# EAGLE schematic Gleichrichter (EAGLE 9.6.2)
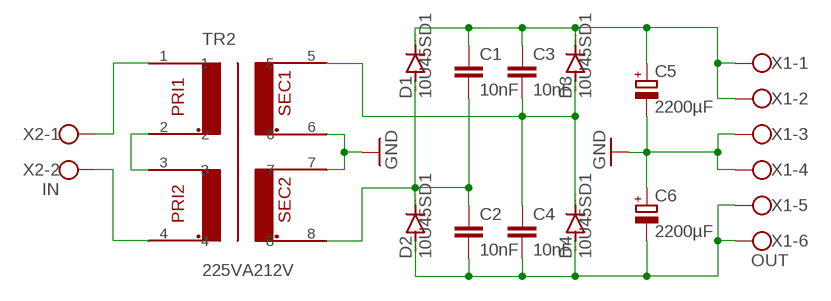
[diagram p0: schematic, sheet 1]

## Parts
C1  10nF  C-EU050-024X044  [C050-024X044]
C2  10nF  C-EU050-024X044  [C050-024X044]
C3  10nF  C-EU050-024X044  [C050-024X044]
C4  10nF  C-EU050-024X044  [C050-024X044]
C5  2200µF  CPOL-EUE5-13  [E5-13]
C6  2200µF  CPOL-EUE5-13  [E5-13]
D1  10U45SD1  1N5400  [DO201-15]
D2  10U45SD1  1N5400  [DO201-15]
D3  10U45SD1  1N5400  [DO201-15]
D4  10U45SD1  1N5400  [DO201-15]
TR2  225VA212V  [RKD225-2X12]
X1  OUT  W237-6  [W237-6]
X2  IN  W237-102  [W237-102]

## Nets
GND: C5.- C6.+ TR2.6 TR2.7 X1.3 X1.4
N$1: C3.2 C4.1 D3.A D4.C TR2.5
N$2: C2.2 C4.2 C6.- D2.A D4.A X1.5 X1.6
N$3: TR2.2 TR2.3
N$4: C1.2 C2.1 D1.A D2.C TR2.8
N$5: C1.1 C3.1 C5.+ D1.C D3.C X1.1 X1.2
N$6: TR2.4 X2.2
N$7: TR2.1 X2.1

## Library data of the parts
C1-C4 = rcl:C-EU: CAPACITOR, European symbol; SPICEPREFIX: C
C5 C6 = rcl:CPOL-EU: POLARIZED CAPACITOR, European symbol; SPICEPREFIX: C
D1-D4 = diode:1N5400: DIODE standard rectifier, 3 A, 50 V (Motorola)
TR2 = bb84:225VA212V
X1 = con-wago-500:W237-6: WAGO SCREW CLAMP; OC_FARNELL: unknown; OC_NEWARK: unknown
X2 = con-wago-500:W237-102: WAGO SCREW CLAMP; MPN: 237-102; OC_FARNELL: unknown; OC_NEWARK: 70K9898